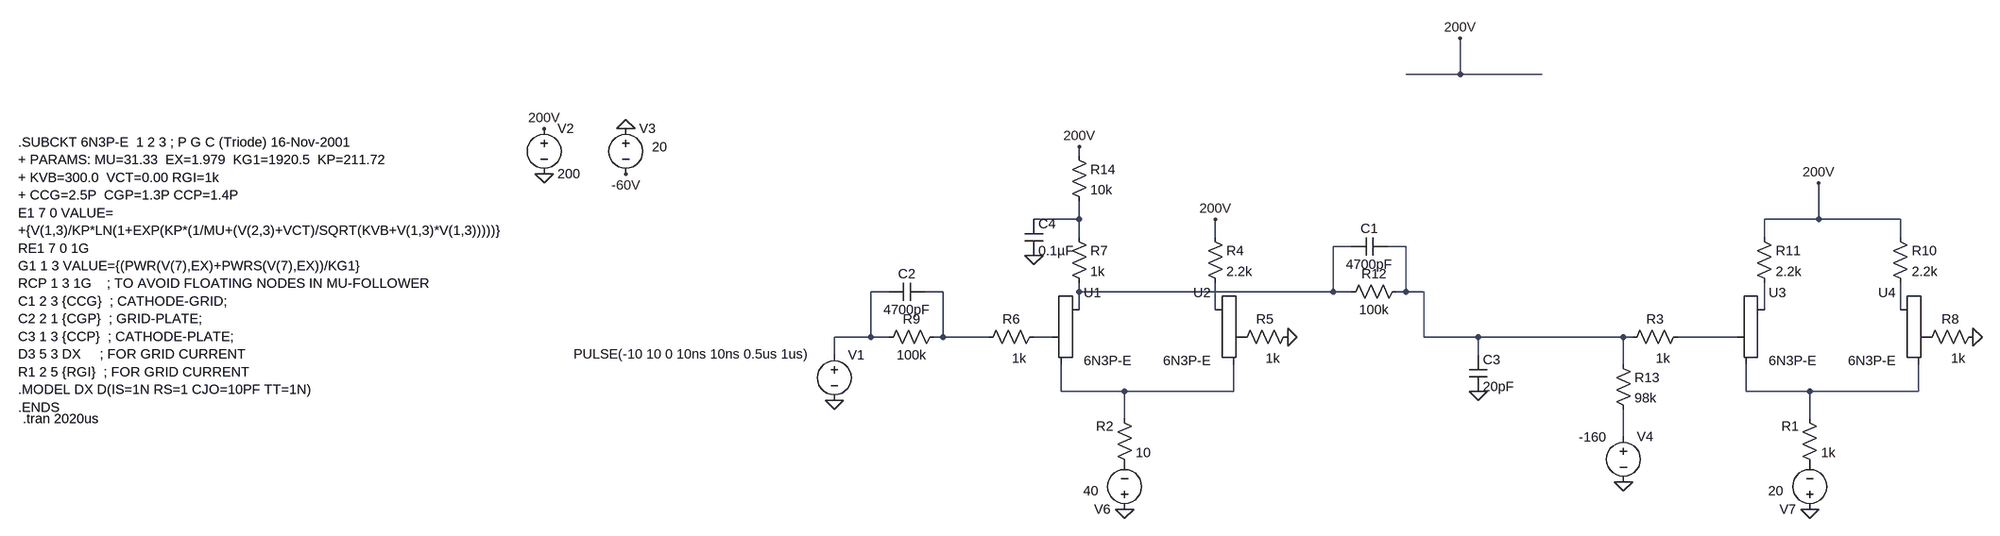
[diagram p0: schematic long-tailed_or.asc]
long-tailed_or.asc, the LTspice schematic file:
Version 4
SHEET 1 2516 760
WIRE 848 -288 848 -352
WIRE 848 -288 752 -288
WIRE 992 -288 848 -288
WIRE 176 -144 176 -160
WIRE 176 -32 176 -64
WIRE 176 -32 96 -32
WIRE 1504 -32 1504 -96
WIRE 1504 -32 1408 -32
WIRE 1648 -32 1504 -32
WIRE 176 0 176 -32
WIRE 416 0 416 -32
WIRE 1408 0 1408 -32
WIRE 1648 0 1648 -32
WIRE 656 16 624 16
WIRE 752 16 720 16
WIRE -160 96 -192 96
WIRE -64 96 -96 96
WIRE 176 96 176 80
WIRE 624 96 624 16
WIRE 624 96 176 96
WIRE 656 96 624 96
WIRE 752 96 752 16
WIRE 752 96 736 96
WIRE 784 96 752 96
WIRE 176 128 176 96
WIRE 416 128 416 80
WIRE 1408 128 1408 80
WIRE 1648 128 1648 80
WIRE -192 176 -192 96
WIRE -192 176 -256 176
WIRE -160 176 -192 176
WIRE -64 176 -64 96
WIRE -64 176 -80 176
WIRE 16 176 -64 176
WIRE 128 176 96 176
WIRE 784 176 784 96
WIRE 880 176 784 176
WIRE 1136 176 880 176
WIRE 1152 176 1136 176
WIRE 1360 176 1232 176
WIRE -256 208 -256 176
WIRE 880 208 880 176
WIRE 1136 224 1136 176
WIRE 144 272 144 224
WIRE 256 272 144 272
WIRE 448 272 448 224
WIRE 448 272 256 272
WIRE 1376 272 1376 224
WIRE 1488 272 1376 272
WIRE 1680 272 1680 224
WIRE 1680 272 1488 272
WIRE 256 320 256 272
WIRE 1488 320 1488 272
WIRE 1136 352 1136 304
FLAG -256 288 0
FLAG -768 -112 0
FLAG -624 -192 0
FLAG -624 -112 -60V
FLAG 848 -352 200V
FLAG -768 -192 200V
FLAG 544 176 0
FLAG 1504 -96 200V
FLAG 1776 176 0
FLAG 1136 432 0
FLAG 256 480 0
FLAG 1488 480 0
FLAG 176 -160 200V
FLAG 416 -32 200V
FLAG 880 272 0
FLAG 96 32 0
SYMBOL Misc\\triode 176 176 R0
SYMATTR InstName U1
SYMATTR Value 6N3P-E
SYMBOL voltage -256 192 R0
WINDOW 3 -460 14 Left 2
WINDOW 123 0 0 Left 0
WINDOW 39 -177 50 Left 2
SYMATTR Value PULSE(-10 10 0 10ns 10ns 0.5us 1us)
SYMATTR InstName V1
SYMBOL voltage -768 -208 R0
WINDOW 123 0 0 Left 0
WINDOW 39 0 0 Left 0
SYMATTR InstName V2
SYMATTR Value 200
SYMBOL res 240 304 R0
WINDOW 0 -34 30 Left 2
SYMATTR InstName R2
SYMATTR Value 10
SYMBOL voltage -624 -208 R0
WINDOW 3 46 48 Left 2
WINDOW 123 0 0 Left 0
WINDOW 39 0 0 Left 0
SYMATTR Value 20
SYMATTR InstName V3
SYMBOL Misc\\triode 416 176 M0
SYMATTR InstName U2
SYMATTR Value 6N3P-E
SYMBOL res 112 160 R90
WINDOW 0 0 56 VBottom 2
WINDOW 3 38 42 VTop 2
SYMATTR InstName R6
SYMATTR Value 1k
SYMBOL res -64 160 R90
WINDOW 0 0 56 VBottom 2
WINDOW 3 32 56 VTop 2
SYMATTR InstName R9
SYMATTR Value 100k
SYMBOL cap -96 80 R90
WINDOW 0 0 32 VBottom 2
WINDOW 3 32 32 VTop 2
SYMATTR InstName C2
SYMATTR Value 4700pF
SYMBOL res 560 160 R90
WINDOW 0 0 56 VBottom 2
WINDOW 3 38 42 VTop 2
SYMATTR InstName R5
SYMATTR Value 1k
SYMBOL res 400 -16 R0
SYMATTR InstName R4
SYMATTR Value 2.2k
SYMBOL res 160 -16 R0
SYMATTR InstName R7
SYMATTR Value 1k
SYMBOL Misc\\triode 1408 176 R0
SYMATTR InstName U3
SYMATTR Value 6N3P-E
SYMBOL res 1472 304 R0
WINDOW 0 -34 30 Left 2
SYMATTR InstName R1
SYMATTR Value 1k
SYMBOL Misc\\triode 1648 176 M0
SYMATTR InstName U4
SYMATTR Value 6N3P-E
SYMBOL res 1248 160 R90
WINDOW 0 0 56 VBottom 2
WINDOW 3 38 42 VTop 2
SYMATTR InstName R3
SYMATTR Value 1k
SYMBOL res 1792 160 R90
WINDOW 0 0 56 VBottom 2
WINDOW 3 38 42 VTop 2
SYMATTR InstName R8
SYMATTR Value 1k
SYMBOL res 1632 -16 R0
SYMATTR InstName R10
SYMATTR Value 2.2k
SYMBOL res 1392 -16 R0
SYMATTR InstName R11
SYMATTR Value 2.2k
SYMBOL res 752 80 R90
WINDOW 0 0 56 VBottom 2
WINDOW 3 32 56 VTop 2
SYMATTR InstName R12
SYMATTR Value 100k
SYMBOL cap 720 0 R90
WINDOW 0 0 32 VBottom 2
WINDOW 3 32 32 VTop 2
SYMATTR InstName C1
SYMATTR Value 4700pF
SYMBOL voltage 1136 336 R0
WINDOW 3 -79 17 Left 2
WINDOW 123 0 0 Left 0
WINDOW 39 -177 50 Left 2
SYMATTR Value -160
SYMATTR InstName V4
SYMBOL res 1120 208 R0
SYMATTR InstName R13
SYMATTR Value 98k
SYMBOL voltage 256 496 R180
WINDOW 3 46 48 Left 2
WINDOW 123 0 0 Left 0
WINDOW 39 0 0 Left 0
SYMATTR Value 40
SYMATTR InstName V6
SYMBOL voltage 1488 496 R180
WINDOW 3 46 48 Left 2
WINDOW 123 0 0 Left 0
WINDOW 39 0 0 Left 0
SYMATTR Value 20
SYMATTR InstName V7
SYMBOL cap 864 208 R0
SYMATTR InstName C3
SYMATTR Value 20pF
SYMBOL res 160 -160 R0
SYMATTR InstName R14
SYMATTR Value 10k
SYMBOL cap 80 -32 R0
SYMATTR InstName C4
SYMATTR Value 0.1µF
TEXT -1696 -168 Left 2 !.SUBCKT 6N3P-E  1 2 3 ; P G C (Triode) 16-Nov-2001\n+ PARAMS: MU=31.33  EX=1.979  KG1=1920.5  KP=211.72 \n+ KVB=300.0  VCT=0.00 RGI=1k\n+ CCG=2.5P  CGP=1.3P CCP=1.4P\nE1 7 0 VALUE=\n+{V(1,3)/KP*LN(1+EXP(KP*(1/MU+(V(2,3)+VCT)/SQRT(KVB+V(1,3)*V(1,3)))))}\nRE1 7 0 1G\nG1 1 3 VALUE={(PWR(V(7),EX)+PWRS(V(7),EX))/KG1}\nRCP 1 3 1G    ; TO AVOID FLOATING NODES IN MU-FOLLOWER\nC1 2 3 {CCG}  ; CATHODE-GRID; \nC2 2 1 {CGP}  ; GRID-PLATE; \nC3 1 3 {CCP}  ; CATHODE-PLATE; \nD3 5 3 DX     ; FOR GRID CURRENT\nR1 2 5 {RGI}  ; FOR GRID CURRENT\n.MODEL DX D(IS=1N RS=1 CJO=10PF TT=1N)\n.ENDS
TEXT -1688 320 Left 2 !.tran 2020us

The netlist it stands for:
* long-tailed_or.asc
XU1 N002 N009 N011 6N3P-E
V1 N004 0 PULSE(-10 10 0 10ns 10ns 0.5us 1us)
V2 200V 0 200
R2 N011 P001 10
V3 0 -60V 20
XU2 N006 P002 N011 6N3P-E
R6 N009 N005 1k
R9 N005 N004 100k
C2 N005 N004 4700pF
R5 0 P002 1k
R4 200V N006 2.2k
R7 N001 N002 1k
XU3 N007 N010 N012 6N3P-E
R1 N012 P003 1k
XU4 N008 P004 N012 6N3P-E
R3 N010 N003 1k
R8 0 P004 1k
R10 200V N008 2.2k
R11 200V N007 2.2k
R12 N003 N002 100k
C1 N003 N002 4700pF
V4 N013 0 -160
R13 N003 N013 98k
V6 0 P001 40
V7 0 P003 20
C3 N003 0 20pF
R14 200V N001 10k
C4 N001 0 0.1µF
.SUBCKT 6N3P-E  1 2 3 ; P G C (Triode) 16-Nov-2001
+ PARAMS: MU=31.33  EX=1.979  KG1=1920.5  KP=211.72
+ KVB=300.0  VCT=0.00 RGI=1k
+ CCG=2.5P  CGP=1.3P CCP=1.4P
E1 7 0 VALUE=
+{V(1,3)/KP*LN(1+EXP(KP*(1/MU+(V(2,3)+VCT)/SQRT(KVB+V(1,3)*V(1,3)))))}
RE1 7 0 1G
G1 1 3 VALUE={(PWR(V(7),EX)+PWRS(V(7),EX))/KG1}
RCP 1 3 1G    ; TO AVOID FLOATING NODES IN MU-FOLLOWER
C1 2 3 {CCG}  ; CATHODE-GRID;
C2 2 1 {CGP}  ; GRID-PLATE;
C3 1 3 {CCP}  ; CATHODE-PLATE;
D3 5 3 DX     ; FOR GRID CURRENT
R1 2 5 {RGI}  ; FOR GRID CURRENT
.MODEL DX D(IS=1N RS=1 CJO=10PF TT=1N)
.ENDS
.tran 2020us
.backanno
.end